# Altium schematic sheet IR_INVERTER.SchDoc: IR_INVERTER
size 420 x 297 mm; Engineer: ALPER KORKMAZ; SheetNumber: 4; SheetTotal: 8; SHEET: 4
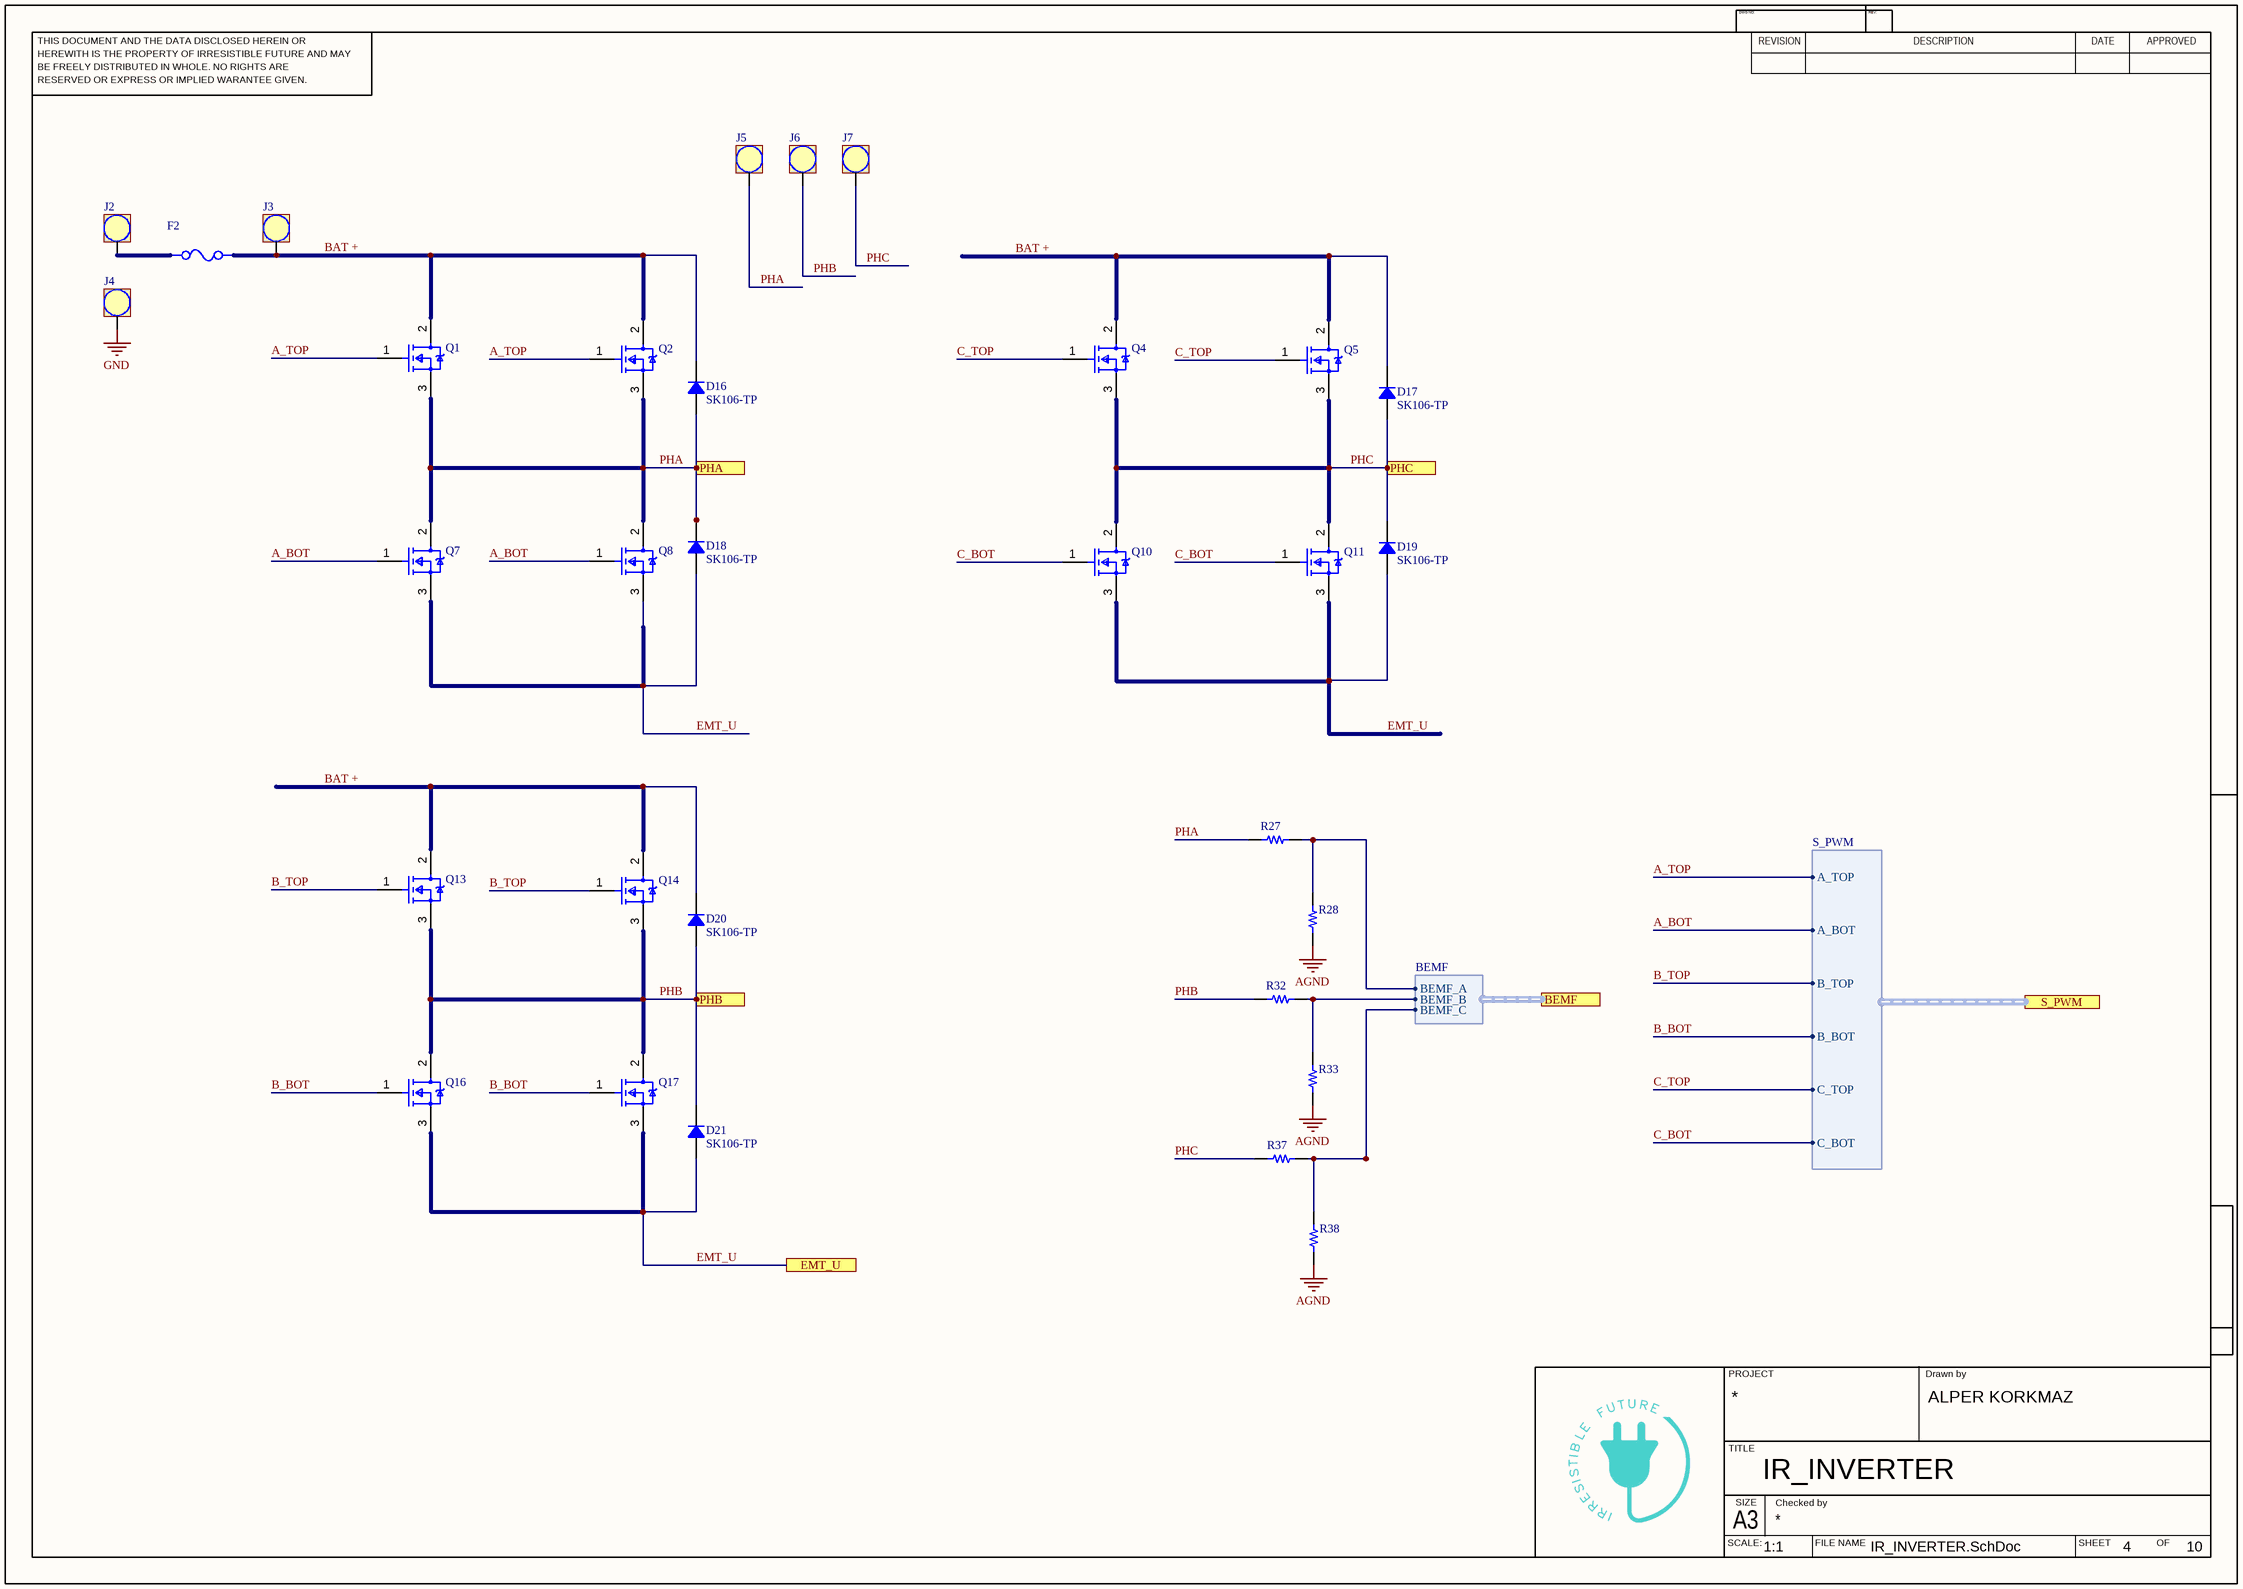
[diagram p0: IR_INVERTER.SchDoc]

## Parts
D16  SK106-TP  [DO214AB SMC]
D17  SK106-TP  [DO214AB SMC]
D18  SK106-TP  [DO214AB SMC]
D19  SK106-TP  [DO214AB SMC]
D20  SK106-TP  [DO214AB SMC]
D21  SK106-TP  [DO214AB SMC]
F2  0498040.M  [FP-0498-MFG]  (value not drawn)
J2  M5 Bush  [7460408_HAL Surface]  (value not drawn)
J3  M5 Bush  [7460408_HAL Surface]  (value not drawn)
J4  M5 Bush  [7460408_HAL Surface]  (value not drawn)
J5  M5 Bush  [7460408_HAL Surface]  (value not drawn)
J6  M5 Bush  [7460408_HAL Surface]  (value not drawn)
J7  M5 Bush  [7460408_HAL Surface]  (value not drawn)
Q1  IRF3205STRLPBF  [FP-PG-TO263-3-MFG]  (value not drawn)
Q2  IRF3205STRLPBF  [FP-PG-TO263-3-MFG]  (value not drawn)
Q4  IRF3205STRLPBF  [FP-PG-TO263-3-MFG]  (value not drawn)
Q5  IRF3205STRLPBF  [FP-PG-TO263-3-MFG]  (value not drawn)
Q7  IRF3205STRLPBF  [FP-PG-TO263-3-MFG]  (value not drawn)
Q8  IRF3205STRLPBF  [FP-PG-TO263-3-MFG]  (value not drawn)
Q10  IRF3205STRLPBF  [FP-PG-TO263-3-MFG]  (value not drawn)
Q11  IRF3205STRLPBF  [FP-PG-TO263-3-MFG]  (value not drawn)
Q13  IRF3205STRLPBF  [FP-PG-TO263-3-MFG]  (value not drawn)
Q14  IRF3205STRLPBF  [FP-PG-TO263-3-MFG]  (value not drawn)
Q16  IRF3205STRLPBF  [FP-PG-TO263-3-MFG]  (value not drawn)
Q17  IRF3205STRLPBF  [FP-PG-TO263-3-MFG]  (value not drawn)
R27  7k Ohms  [RES 0603_1608]  (value not drawn)
R28  2k Ohms  [RES 0603_1608]  (value not drawn)
R32  7k Ohms  [RES 0603_1608]  (value not drawn)
R33  2k Ohms  [RES 0603_1608]  (value not drawn)
R37  7k Ohms  [RES 0603_1608]  (value not drawn)
R38  2k Ohms  [RES 0603_1608]  (value not drawn)

## Ports
BEMF (harness BEMF, see 1[5A], 3[5B]), EMT_U (see 1[4A], 5[3B]), PHA (see 1[4A], 5[3B]), PHB (see 1[4A], 5[3C]), PHC (see 1[4A], 5[5B]), S_PWM (harness S_PWM, see 1[4A], 5[5C])

## Harnesses
BEMF: BEMF_A, BEMF_B, BEMF_C
S_PWM: A_TOP, A_BOT, B_TOP, B_BOT, C_TOP, C_BOT

## Nets
AGND: R28.1 R33.1 R38.1
GND: J4.1
A_BOT: Q7.1(G) Q8.1(G) ; port S_PWM.A_BOT
A_TOP: Q1.1(G) Q2.1(G) ; port S_PWM.A_TOP
B_BOT: Q16.1(G) Q17.1(G) ; port S_PWM.B_BOT
B_TOP: Q13.1(G) Q14.1(G) ; port S_PWM.B_TOP
BAT +: D16.2 D17.2 D20.2 J3.1 Q1.2(D) Q2.2(D) Q4.2(D) Q5.2(D) Q13.2(D) Q14.2(D)
C_BOT: Q10.1(G) Q11.1(G) ; port S_PWM.C_BOT
C_TOP: Q4.1(G) Q5.1(G) ; port S_PWM.C_TOP
EMT_U: D18.1 D19.1 D21.1 Q7.3(S) Q8.3(S) Q10.3(S) Q11.3(S) Q16.3(S) Q17.3(S) ; port EMT_U
PHA: D16.1 D18.2 J5.1 Q1.3(S) Q2.3(S) Q7.2(D) Q8.2(D) R27.1 ; port PHA
PHB: D20.1 D21.2 J6.1 Q13.3(S) Q14.3(S) Q16.2(D) Q17.2(D) R32.1 ; port PHB
PHC: D17.1 D19.2 J7.1 Q4.3(S) Q5.3(S) Q10.2(D) Q11.2(D) R37.1 ; port PHC
NetR27_2: R27.2 R28.2 ; port BEMF.BEMF_A
NetR32_2: R32.2 R33.2 ; port BEMF.BEMF_B
NetR37_2: R37.2 R38.2 ; port BEMF.BEMF_C

Not connected (* = marked no-connect by the designer): J2 1

## Notes on the sheet
- THIS DOCUMENT AND THE DATA DISCLOSED HEREIN OR
- HEREWITH IS THE PROPERTY OF IRRESISTIBLE FUTURE AND MAY
- DWG NO:
- REVISION
- REV:
- DESCRIPTION
- DATE
- APPROVED
- BE FREELY DISTRIBUTED IN WHOLE. NO RIGHTS ARE
- RESERVED OR EXPRESS OR IMPLIED WARANTEE GIVEN.
- PROJECT
- Drawn by
- TITLE
- SCALE:
- A3
- SIZE
- Checked by
- FILE NAME
- SHEET
- OF
- 1:1
- 10

## Library data of the parts
D16-D21 = SK106-TP: DIODE SCHOTTKY 60V 10A DO214AB; Manufacturer: Micro Commercial Co; Capacitance @ Vr, F: 500pF @ 4V, 1MHz; Current - Reverse Leakage @ Vr: 1mA @ 60V; Speed: Fast Recovery =< 500ns, > 200mA (Io); Voltage - Forward (Vf) (Max) @ If: 850mV @ 10A; Part Number: SK106-TP; ComponentLink1Description: Datasheet; ComponentLink1URL: https://www.mccsemi.com/pdf/Products/SK102-SK1010(HSMC).PDF; ComponentLink2Description: DigiKey Link; ComponentLink2URL: http://digikey.com/product-detail/en/micro-commercial-co/SK106-TP/SK106-TPTR-ND/1306162; Current - Average Rectified (Io): 10A; Diode Type: Schottky; LastUpdated: 21.07.2022 04:40:05; Lifecycle Status: Active; Minimum Order: 0; Mounting Type: Surface Mount; Operating Temperature - Junction: -55°C ~ 125°C; Package / Case: DO-214AB, SMC; Packaging: TapeAndReel; PartId: 1760; Part Status: Active; Price: 0.29; Series: -; Supplier 1: DigiKey; Supplier Part Number 1: SK106-TPTR-ND; Supplier Device Package: DO-214AB (HSMC); Voltage - DC Reverse (Vr) (Max): 60V
F2 = CMP-08605-000064-1: FUSE AUTO 40A 32VDC AUTO LINK; Manufacturer: Littelfuse Inc; Resistance: 1.398mΩ; Voltage Rating: 32V; Fuse Interrupt Dc Current: 1000A; Fuse I2T: 10000A2Sec; Value: 1.398mΩ; Fuse Voltage Drop: 65mV; Fuse Blow Speed: Slow; Height: 8mm; Package: 0498; Octopart: https://octopart.com/0498040.m-littelfuse-561198; ComponentLink2Description: Datasheet; Temperature: -40°C to +125°C; Lead Free: Yes; Device Class L1: Circuit Protection; Device Class L2: Fuses; RoHS: TRUE; Max Fuse Dc Voltage: 32V; Mouser Description: Automotive Fuses 32V 40A; ComponentLink2URL: https://www.littelfuse.com/~/media/automotive/datasheets/fuses/passenger-car-and-commercial-vehicle/bolt-down-fuses/littelfuse_midi_datasheet.pdf; Category: Fuse; Fuse Current: 40A; Device Class L3: unset; Temperature Range High: +125°C; Temperature Range Low: -40°C; Automotive: Yes; Manufacturer Part Number: 0498040.M; Digikey Description: FUSE AUTO 40A 32VDC AUTO LINK
J2-J7 = 7460408: Bush with Circumference M5; Brand: Wurth; Case Style: M5Bush; Brand Number: 7460408; Order Code Supplier: 1821279; Price: 4,17; Supplier: Farnell
Q1 Q2 Q4 Q5 Q7 Q8 Q10 Q11 Q13 Q14 Q16 Q17 = CMP-32901-000011-1: MOSFET N-CH 55V 110A D2PAK; Manufacturer: Infineon Technologies; Threshold Vgs Min: 2V; Turn Off Delay Time: 50ns; Pulse Drain Current: 390A; Max Forward Diode Voltage: 1.3V; Number Of Channels: 1; Threshold Vgs Max: 4V; Gate To Source Voltage: 20V; Input Capacitace At Vds: 3247pF @ 25V; Depletion Mode: False; Reverse Recovery Time: 69ns; Standoff Height: 0mm; Turn On Delay Time: 14ns; Gate Charge At Vgs: 146nC @ 10V; Drain To Source Resistance: 8mΩ; Rthja Max: 40°C/W; Power Dissipation: 200W; Max Junction Temp: +175°C; Reverse Recovery Charge: 143nC; ComponentLink2Description: Datasheet; Temperature Range Low: -55°C; ComponentLink2URL: https://www.infineon.com/dgdl/irf3205spbf.pdf?fileId=5546d462533600a4015355defac9190c; Automotive: No; Height: 5.084mm; Lead Free: Yes; Device Class L1: Discrete Semiconductors; Drain To Source Voltage: 55V; Device Class L3: MOSFETs; Temperature: -55°C to +175°C; Drain To Source Breakdown Voltage: 55V; Manufacturer Part Number: IRF3205STRLPBF; Temperature Range High: +175°C; Device Class L2: Transistors; Octopart: https://octopart.com/irf3205strlpbf-infineon-65873335; Digikey Description: MOSFET N-CH 55V 110A D2PAK; RoHS: TRUE; Number Of N Channels: 1; Continuous Drain Current: 110A; Category: Trans; Package: PG-TO263-3
R27 R28 R32 R33 R37 R38 = RNCS0603BKE10K0: RES 10K OHM 0.1% 1/16W 0603; Manufacturer: Stackpole Electronics Inc; Power (Watts): 0.063W, 1/16W; Resistance: 10 kOhms; Temperature Coefficient: ±25ppm/°C; Part Number: RNCS0603BKE10K0; ComponentLink1Description: Datasheet; ComponentLink1URL: https://www.seielect.com/catalog/sei-rncs_rnch.pdf; ComponentLink2Description: DigiKey Link; ComponentLink2URL: https://www.digikey.com/en/products/detail/stackpole-electronics-inc/RNCS0603BKE10K0/1708836; Composition: Thin Film; Device Package: 0603 (1608 Metric); Features: Anti-Corrosive, Automotive AEC-Q200, Moisture Resistant; Height - Seated (Max): 0.022" (0.55mm); LastUpdated: 23.05.2022 13:14:49; Lifecycle Status: Active; Minimum Order: 1; Number of Terminations: 2; Operating Temperature: -55°C ~ 155°C; Package / Case: 0603 (1608 Metric); Packaging: TapeAndReel; PartId: 4838; Part Status: Active; Price: 0.08; Ratings: AEC-Q200; Series: RNCS; Size / Dimension: 0.061" L x 0.031" W (1.55mm x 0.80mm); Supplier 1: DigiKey; Supplier Part Number 1: RNCS0603BKE10K0CT-ND; Supplier Device Package: 0603; Tolerance: ±0.1%
  R27 R32 R37: Value: 7k Ohms
  R28 R33 R38: Value: 2k Ohms